# EAGLE design time (EAGLE 7.4.0)
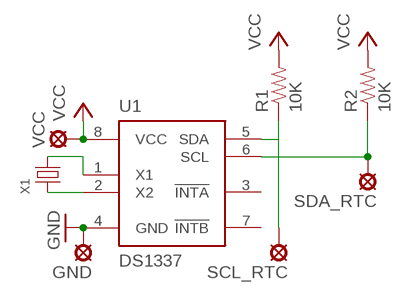
[diagram p0: schematic, sheet 1]

## Parts
GND  SE13  [SE13]
R1  10K  10KOHM-1/10W-1%(0603)0603  [0603-RES]
R2  10K  10KOHM-1/10W-1%(0603)0603  [0603-RES]
SCL_RTC  SE13  [SE13]
SDA_RTC  SE13  [SE13]
U1  DS1337  [UMAX8]
VCC  SE13  [SE13]
X1  CRYSTAL8X3.5MM  [CRYSTAL-8X3.5MM]

## Nets
GND: GND.MP U1.4(GND)
N$1: U1.2(X2) X1.1
N$2: U1.1(X1) X1.4
N$3: R1.1 SCL_RTC.MP U1.5(SDA)
N$4: R2.1 SDA_RTC.MP U1.6(SCL)
VCC: R1.2 R2.2 U1.8(VCC) VCC.MP
Unconnected: U1.3(!INTA) U1.7(!INTB)

## Library data of the parts
GND SCL_RTC SDA_RTC VCC = solpad:SE13: SOLDER PAD E1542, drill 1,3mm, distributor Buerklin, 07F815
R1 R2 = SparkFun-Resistors:10KOHM-1/10W-1%(0603): RES-00824; PROD_ID: RES-00824
U1 = ds1337:DS1337: Real-time clock IC
X1 = ds1337:CRYSTAL

## Board
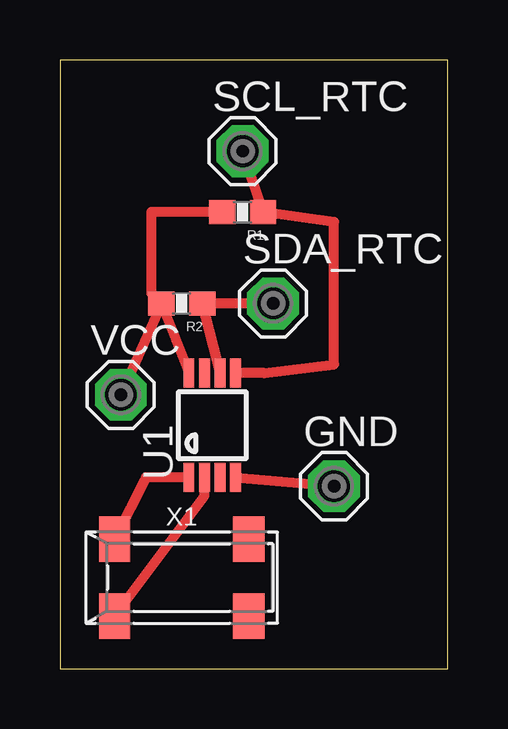
[diagram p1: board, top side]

Size 16.18 x 25.39 mm. Coordinates in mm from the lower left corner, seen from the top.
Outline: 0,0 16.18,0 16.18,25.39 0,25.39 0,0
Copper layers (1*16): Top 0.035mm / dielectric 1.5mm / Bottom 0.035mm
Design rules "default": minimum track width 10mil, minimum drill 24mil, track to track 8mil, track to pad 8mil, pad to pad 8mil, via to via 8mil, smd to smd 8mil, copper to edge 40mil, drill to drill 8mil, minimum pad ring 10mil, minimum via ring 8mil, stop-mask expansion 4mil, vias tented up to drill 0mil, thermal gap 10mil

### Footprints (pad centres in the part's own frame; a part is rotated, then mirrored left to right if it is on the bottom)
SE13 = drill 1.321 pad 2.159 octagon: MP 0,0
0603-RES = smd 1.1 x 1: 1 -0.85,0; 2 0.85,0
UMAX8 = smd 0.45 x 1.2: 1 -0.975,-2.175; 2 -0.325,-2.175; 3 0.325,-2.175; 4 0.975,-2.175; 5 0.975,2.175; 6 0.325,2.175; 7 -0.325,2.175; 8 -0.975,2.175
CRYSTAL-8X3.5MM = smd 1.3 x 1.9: 1 -2.794,-1.6; 2 2.794,-1.6; 3 2.794,1.6; 4 -2.794,1.6

### Placement (x,y rotation side)
GND  11.43,7.62 0 top
R1  7.62,19.05 180 top
R2  5.08,15.24 180 top
SCL_RTC  7.62,21.59 0 top
SDA_RTC  8.89,15.24 0 top
U1  6.35,10.16 0 top
VCC  2.54,11.43 0 top
X1  5.08,3.81 0 top

### Tracks (layer width: path | path; a pad name or v marks a point on that pad's centre or on a via)
GND
  Top 0.406: U1.4 GND.MP
N$1
  Top 0.406: X1.1 6.02,7.22 U1.2
N$2
  Top 0.406: U1.1 3.59,7.98 X1.4
N$3
  Top 0.406: U1.5 8.52,12.34 11.43,12.7 11.43,18.63 R1.1 SCL_RTC.MP
N$4
  Top 0.406: U1.6 R2.1 SDA_RTC.MP
VCC
  Top 0.406: R1.2 3.81,19.05 3.81,15.66 R2.2 | R2.2 VCC.MP | R2.2 U1.8